# Altium project Sensor_Box_CAN_Shutter_CTRL_STM.PrjPCB
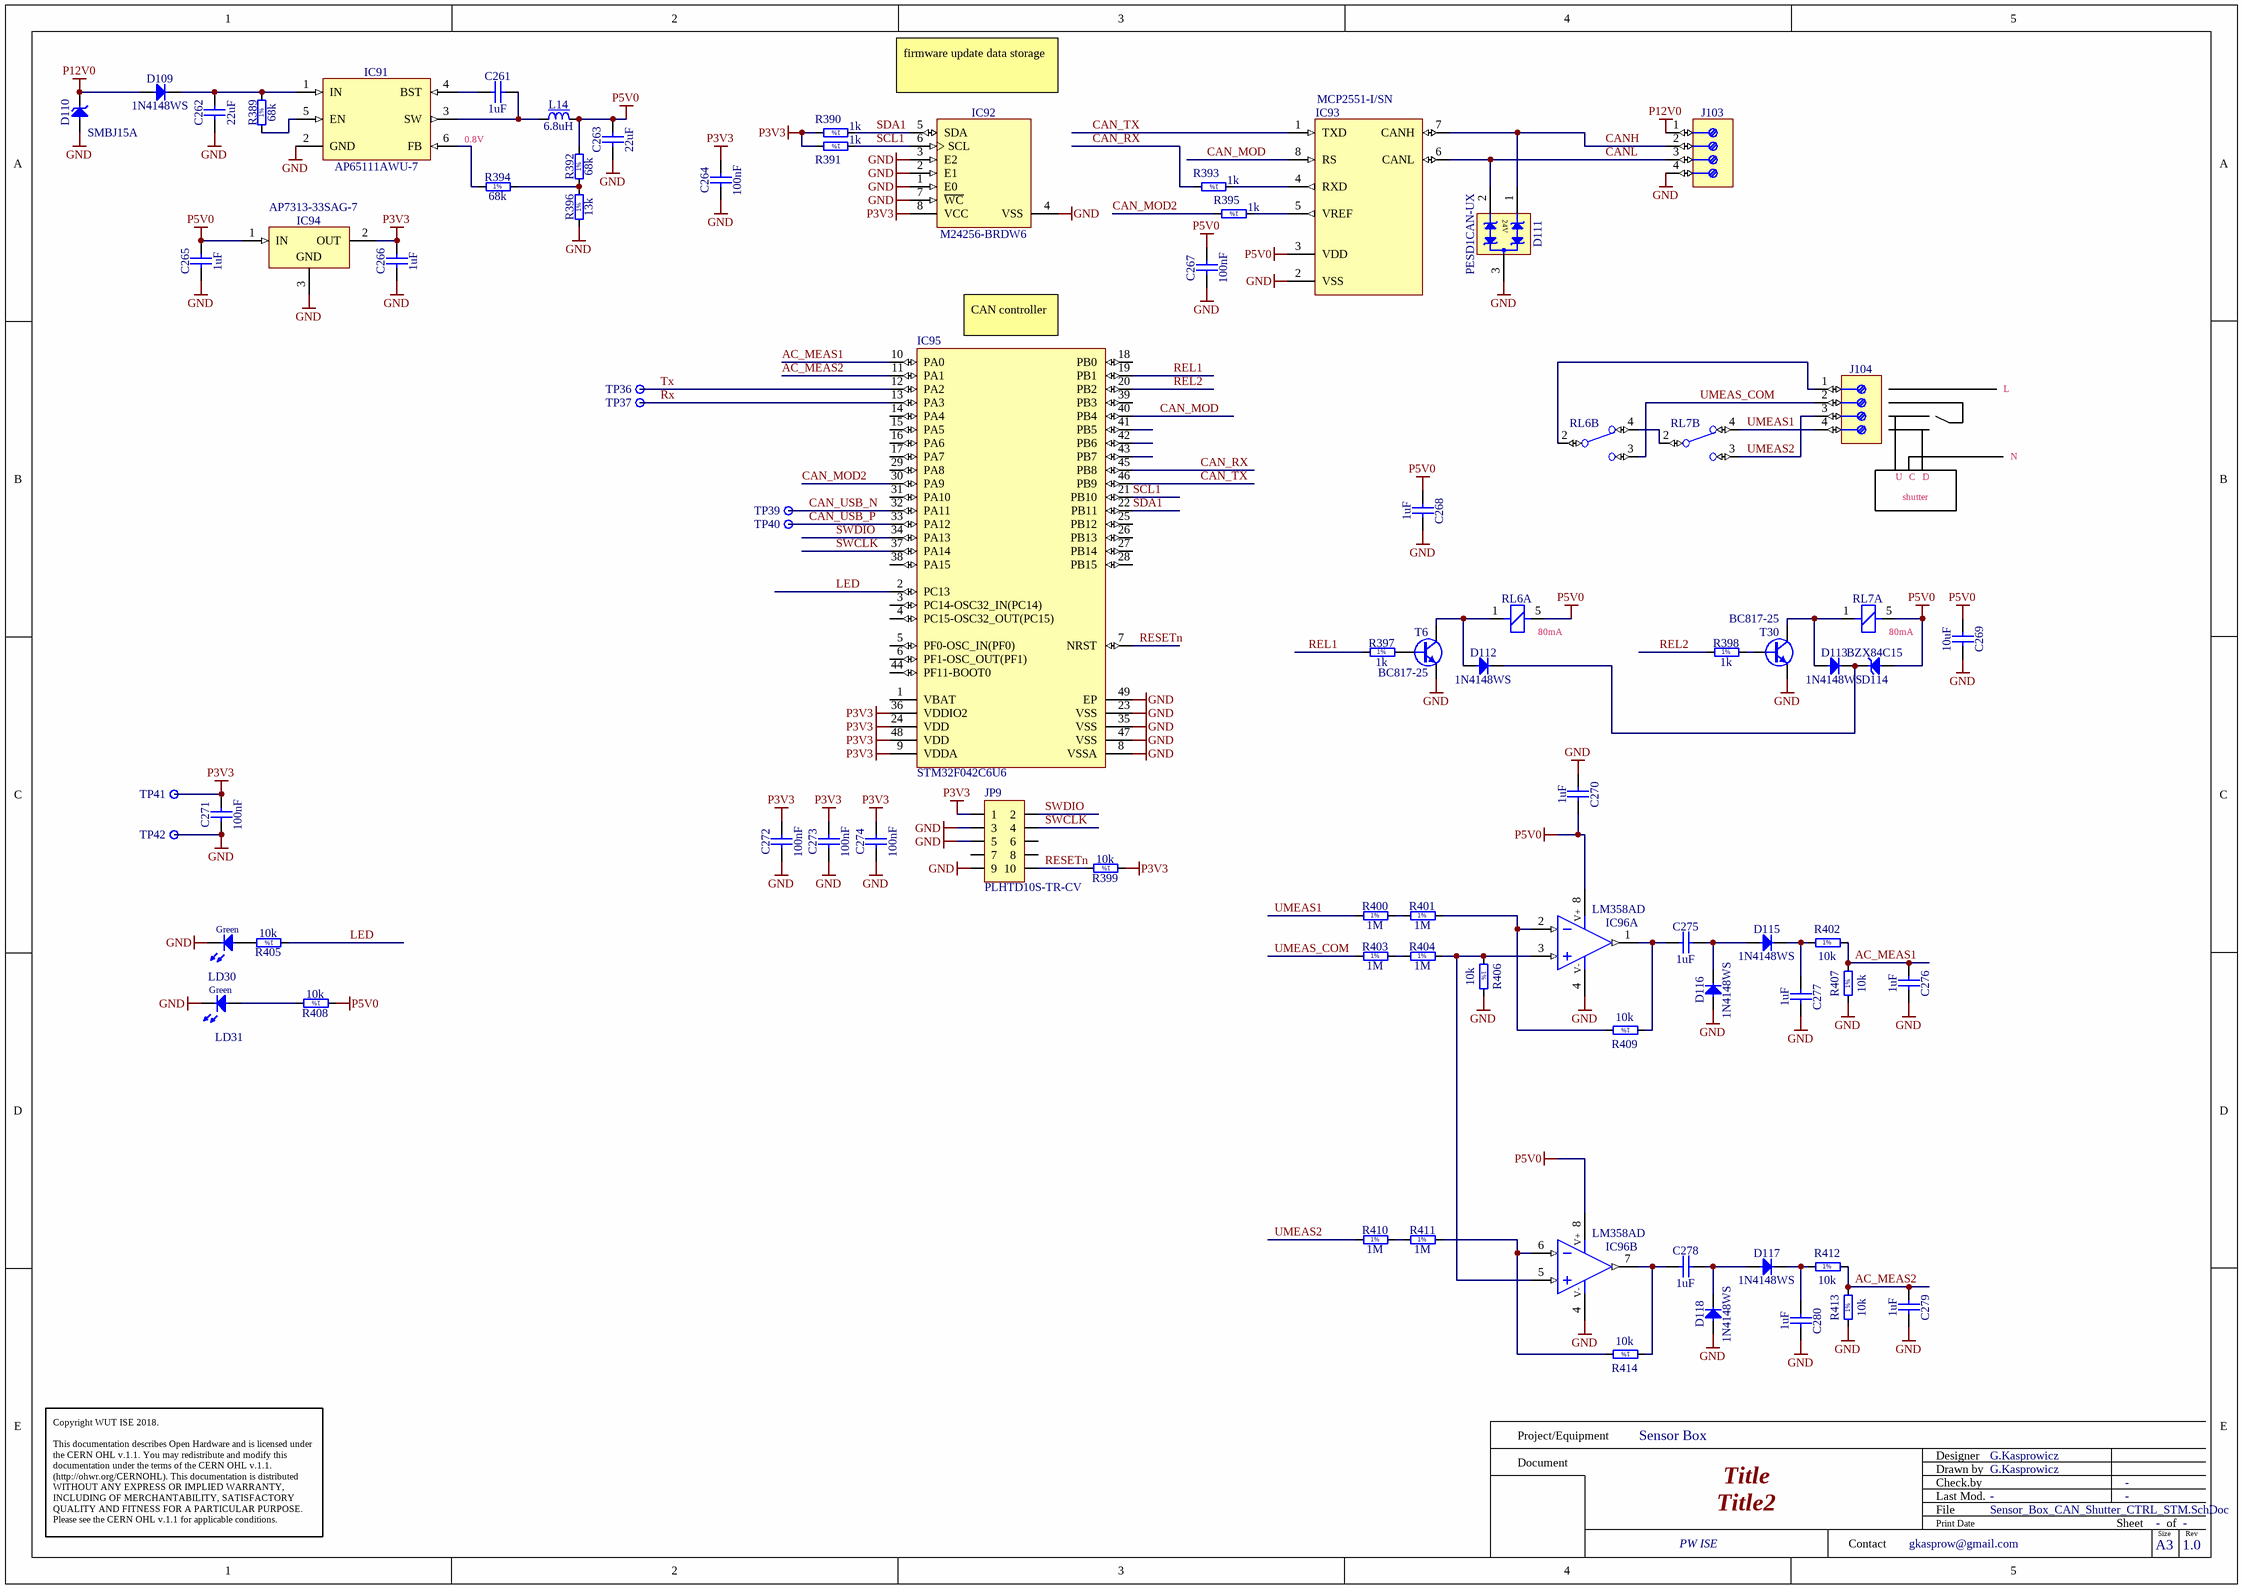
[diagram p0: Sensor_Box_CAN_Shutter_CTRL_STM.SchDoc]
1 sheet, 78 parts. Net scope: global (net labels, ports and power ports of the same name join across sheets).
Board file: Sensor_Box_CAN_Shutter_CTRL_STM.PCBDOC

## Sheet Sensor_Box_CAN_Shutter_CTRL_STM.SchDoc: Title
size 420 x 297 mm; Author: G.Kasprowicz; CompanyName: WUT ISE; DrawnBy: G.Kasprowicz; Organization: WUT ISE; Address1: PW ISE; Address2: Nowowiejska 15/19 00-665 Warsaw; Address3: gkasprow@gmail.com; Revision: 1.0; SheetNumber: -; SheetTotal: -; ModifiedBy: -; CheckedDate: -; Title2: Title2; DivGrp: WUT ISE; Designer: G.Kasprowicz; ModifiedDate: -; ProjectName: Sensor Box

### Parts
C261  1uF  [CAPC1005X55N]
C262  22uF  [CAPC1709X100N]
C263  22uF  [CAPC1709X100N]
C264  100nF  [CAPC1005X55N]
C265  1uF  [CAPC1005X55N]
C266  1uF  [CAPC1005X55N]
C267  100nF  [CAPC1005X55N]
C268  1uF  [CAPC1005X55N]
C269  10uF  [CAPC2012X135N]
C270  1uF  [CAPC1005X55N]
C271  100nF  [CAPC1005X55N]
C272  100nF  [CAPC1005X55N]
C273  100nF  [CAPC1005X55N]
C274  100nF  [CAPC1005X55N]
C275  1uF  [CAPC1005X55N]
C276  1uF  [CAPC1005X55N]
C277  1uF  [CAPC1005X55N]
C278  1uF  [CAPC1005X55N]
C279  1uF  [CAPC1005X55N]
C280  1uF  [CAPC1005X55N]
D109  1N4148WS  [SODFL2512X100N]
D110  SMBJ15A  [DIOM5336X265N]
D111  PESD1CAN-UX  [SOT95P237X112-3N]
D112  1N4148WS  [SODFL2512X100N]
D113  1N4148WS  [SODFL2512X100N]
D114  BZX84C15  [SOT95P240X130-3N]
D115  1N4148WS  [SODFL2512X100N]
D116  1N4148WS  [SODFL2512X100N]
D117  1N4148WS  [SODFL2512X100N]
D118  1N4148WS  [SODFL2512X100N]
IC91  AP65111AWU-7  [SOT95P280X100-6N]
IC92  M24256-BRDW6  [SOP65P640X120-8N]
IC93  MCP2551-I/SN  [SOIC127P600X175-8N]
IC94  AP7313-33SAG-7  [SOT95P240X130-3N]
IC95  STM32F042C6U6  [STM-UFQFPN48_L]
IC96  LM358AD  [SOIC127P600X175-8N]  (parts A,B of 2)
J103  (no value)  [PHOENIX_1725672]
J104  (no value)  [TYCO_282836-4]
JP9  PLHTD10S-TR-CV  [PLHTD10S-TR-CV]
L14  6.8uH  [IND_WALSIN_WLPN3030]
LD30  Green  [LED_KINGBRIGHT_KPH-1608CGCK]
LD31  Green  [LED_KINGBRIGHT_KPH-1608CGCK]
R389  68k  [RESC1005X40N]
R390  1k  [RESC1005X40N]
R391  1k  [RESC1005X40N]
R392  68k  [RESC1005X40N]
R393  1k  [RESC1005X40N]
R394  68k  [RESC1005X40N]
R395  1k  [RESC1005X40N]
R396  13k  [RESC1005X40N]
R397  1k  [RESC1005X40N]
R398  1k  [RESC1005X40N]
R399  10k  [RESC1005X40N]
R400  1M  [RESC3216X65N]
R401  1M  [RESC3216X65N]
R402  10k  [RESC1005X40N]
R403  1M  [RESC3216X65N]
R404  1M  [RESC3216X65N]
R405  10k  [RESC1005X40N]
R406  10k  [RESC1005X40N]
R407  10k  [RESC1005X40N]
R408  10k  [RESC1005X40N]
R409  10k  [RESC1005X40N]
R410  1M  [RESC3216X65N]
R411  1M  [RESC3216X65N]
R412  10k  [RESC1005X40N]
R413  10k  [RESC1005X40N]
R414  10k  [RESC1005X40N]
RL6  REL_OMRON_G5Q-1  [REL_OMRON_G5Q-1]  (value not drawn)  (parts A,B of 2)
RL7  REL_OMRON_G5Q-1  [REL_OMRON_G5Q-1]  (value not drawn)  (parts A,B of 2)
T6  BC817-25  [SOT95P230X110-3N]
T30  BC817-25  [SOT95P230X110-3N]
TP36  Test Point  [TPS127]  (value not drawn)
TP37  Test Point  [TPS127]  (value not drawn)
TP39  Test Point  [TPS127]  (value not drawn)
TP40  Test Point  [TPS127]  (value not drawn)
TP41  Test Point  [TPS127]  (value not drawn)
TP42  Test Point  [TPS127]  (value not drawn)

### Nets
GND: C262.1 C263.1 C264.1 C265.1 C266.1 C267.1 C268.2 C269.2 C270.1 C271.1 C272.1 C273.1 C274.1 C276.2 C277.2 C279.2 C280.2 D110.2(A) D111.3(GND) D116.2(A) D118.2(A) IC91.2(GND) IC92.1(E0) IC92.2(E1) IC92.3(E2) IC92.4(VSS) IC92.7(~{WC}) IC93.2(VSS) IC94.3(GND) IC95.8(VSSA) IC95.23(VSS) IC95.35(VSS) IC95.47(VSS) IC95.49(EP) IC96.4(V-) J103.4 JP9.3 JP9.5 JP9.9 LD30.1(C) LD31.1(C) R396.1 R406.2 R407.1 R413.1 T6.2(E) T30.2(E) TP42.1
P3V3: C264.2 C266.2 C271.2 C272.2 C273.2 C274.2 IC92.8(VCC) IC94.2(OUT) IC95.9(VDDA) IC95.24(VDD) IC95.36(VDDIO2) IC95.48(VDD) JP9.1 R390.2 R391.2 R399.1 TP41.1
P5V0: C263.2 C265.2 C267.2 C268.1 C269.1 C270.2 D114.1(A) IC93.3(VDD) IC94.1(IN) IC96.8(V+) L14.2 R392.2 R408.1 RL6.5 RL7.5
P12V0: D109.2(A) D110.1(C) J103.1
AC_MEAS1: C276.1 IC95.10(PA0) R402.2 R407.2
AC_MEAS2: C279.1 IC95.11(PA1) R412.2 R413.2
CAN_MOD: IC93.8(RS) IC95.40(PB4)
CAN_MOD2: IC95.30(PA9) R395.2
CAN_RX: IC95.45(PB8) R393.2
CAN_TX: IC93.1(TXD) IC95.46(PB9)
CAN_USB_N: IC95.32(PA11) TP39.1
CAN_USB_P: IC95.33(PA12) TP40.1
CANH: D111.1(I/O1) IC93.7(CANH) J103.2
CANL: D111.2(I/O2) IC93.6(CANL) J103.3
LED: IC95.2(PC13) R405.1
REL1: IC95.19(PB1) R397.1
REL2: IC95.20(PB2) R398.1
RESETn: IC95.7(NRST) JP9.10 R399.2
Rx: IC95.13(PA3) TP37.1
SCL1: IC92.6(SCL) IC95.21(PB10) R391.1
SDA1: IC92.5(SDA) IC95.22(PB11) R390.1
SWCLK: IC95.37(PA14) JP9.4
SWDIO: IC95.34(PA13) JP9.2
Tx: IC95.12(PA2) TP36.1
UMEAS1: J104.4 R400.1 RL7.4(NC)
UMEAS2: J104.3 R410.1 RL7.3(NO)
UMEAS_COM: J104.2 R403.1 RL6.3(NO)
NetC261_1: C261.1 IC91.4(BST)
NetC261_2: C261.2 IC91.3(SW) L14.1
NetC262_2: C262.2 D109.1(C) IC91.1(IN) R389.2
NetC275_1: C275.1 IC96.1(OUT) R409.1
NetC275_2: C275.2 D115.2(A) D116.1(C)
NetC277_1: C277.1 D115.1(C) R402.1
NetC278_1: C278.1 IC96.7(OUT) R414.1
NetC278_2: C278.2 D117.2(A) D118.1(C)
NetC280_1: C280.1 D117.1(C) R412.1
NetD112_1: D112.1(C) D113.1(C) D114.3(C)
NetD112_2: D112.2(A) RL6.1 T6.3(C)
NetD113_2: D113.2(A) RL7.1 T30.3(C)
NetIC91_5: IC91.5(EN) R389.1
NetIC91_6: IC91.6(FB) R394.1
NetIC93_4: IC93.4(RXD) R393.1
NetIC93_5: IC93.5(VREF) R395.1
NetIC96_2: IC96.2(IN-) R401.2 R409.2
NetIC96_3: IC96.3(IN+) IC96.5(IN+) R404.2 R406.1
NetIC96_6: IC96.6(IN-) R411.2 R414.2
NetJ104_1: J104.1 RL6.2(C)
NetLD30_2: LD30.2(A) R405.2
NetLD31_2: LD31.2(A) R408.2
NetR392_1: R392.1 R394.2 R396.2
NetR397_2: R397.2 T6.1(B)
NetR398_2: R398.2 T30.1(B)
NetR400_2: R400.2 R401.1
NetR403_2: R403.2 R404.1
NetR410_2: R410.2 R411.1
NetRL6_4: RL6.4(NC) RL7.2(C)

Not connected (* = marked no-connect by the designer): IC95 1(VBAT) 3(PC14-OSC32_IN(PC14)) 4(PC15-OSC32_OUT(PC15)) 5(PF0-OSC_IN(PF0)) 6(PF1-OSC_OUT(PF1)) 14(PA4) 15(PA5) 16(PA6) 17(PA7) 18(PB0) 25(PB12) 26(PB13) 27(PB14) 28(PB15) 29(PA8) 31(PA10) 38(PA15) 39(PB3) 41(PB5) 42(PB6) 43(PB7) 44(PF11-BOOT0); JP9 6 7 8

### Notes on the sheet
- firmware update data storage
- 0.8V
- (near IC95) CAN controller
- L
- N
- U
- shutter
- C
- D
- (near RL6) 80mA
- (near RL7) 80mA
- Project/Equipment
- Document
- Designer
- Drawn by
- Check.by
- Copyright WUT ISE 2018.
  This documentation describes Open Hardware and is licensed under the CERN OHL v.1.1. You may redistribute and modify this documentation under the terms of the CERN OHL v.1.1. (http://ohwr.org/CERNOHL). This documentation is distributed WITHOUT ANY EXPRESS OR IMPLIED WARRANTY, INCLUDING OF MERCHANTABILITY, SATISFACTORY QUALITY AND FITNESS FOR A PARTICULAR PURPOSE. Please see the CERN OHL v.1.1 for applicable conditions.
- Contact
- File
- Last Mod.
- Print Date
- Sheet
- Size
- A3
- of
- Rev
- (in symbol R0402_1K_1%_0.0625W_100PPM) 1%
- (in symbol R0402_10K_1%_0.0625W_100PPM) 1%
- (in symbol R0402_13K_1%_0.0625W_100PPM) 1%
- (in symbol R0402_68K_1%_0.0625W_100PPM) 1%
- (in symbol R1206_1M_1%_0.25W_100PPM) 1%

### Library data of the parts
C261 C265 C266 C268 C270 C275-C280 = CC0402_1UF_16V_10%_X5R: Non-polarised capacitor; Part Description: SMD Multilayer Chip Ceramic Capacitor; Manufacturer: GENERIC; Manufacturer1 Part Number: C1005X5R1C105KT; Voltage: 16V; TC: X5R; Tolerance: ±10%; Part Number: CC0402_1UF_16V_10%_X5R; Component Kind: Standard; Component Type: Standard; Pin Count: 2; Value: 1uF; Status: Preferred; Manufacturer Part Number: CC0402_1UF_16V_10%_X5R; Case: 0402; Mounted: Yes; Socket: No; SMD: Yes; Sense: No; Manufacturer1 Example: TDK; Manufacturer1 ComponentHeight: 0.55mm; HelpURL: \\cern.ch\dfs\Applications\Altium\Datasheets\CC0402_X5R_TDK_C.pdf; Author: CERN DEM JLC; CreateDate: 25.10.2012; LatestRevisionDate: 25.10.2012
C262 C263 = CC0603_22UF_6.3V_20%_X5R: Non-polarised capacitor; Part Description: SMD Multilayer Chip Ceramic Capacitor; Manufacturer: GENERIC; Manufacturer1 Part Number: C1608X5R0J226M080AC; Voltage: 6.3V; TC: X5R; Tolerance: ±20%; Part Number: CC0603_22UF_6.3V_20%_X5R; Component Kind: Standard; Component Type: Standard; Pin Count: 2; Value: 22uF; Status: None; Manufacturer Part Number: CC0603_22UF_6.3V_20%_X5R; Case: 0603; Mounted: Yes; Socket: No; SMD: Yes; Sense: No; Manufacturer1 Example: TDK; Manufacturer1 ComponentHeight: 1mm; HelpURL: \\cern.ch\dfs\Applications\Altium\Datasheets\CC0603_X5R_TDK_C.pdf; Author: CERN DEM JLC; CreateDate: 16.12.2013; LatestRevisionDate: 13.09.2016
C264 C267 C271-C274 = CC0402_100NF_16V_10%_X5R: Non-polarised capacitor; Part Description: SMD Multilayer Chip Ceramic Capacitor; Manufacturer: GENERIC; Manufacturer1 Part Number: GRM155R61C104KA88D; Voltage: 16V; TC: X5R; Tolerance: ±10%; Part Number: CC0402_100NF_16V_10%_X5R; Component Kind: Standard; Component Type: Standard; Pin Count: 2; Value: 100nF; Status: None; Manufacturer Part Number: CC0402_100NF_16V_10%_X5R; Case: 0402; Mounted: Yes; Socket: No; SMD: Yes; Sense: No; Manufacturer1 Example: MURATA; Manufacturer1 ComponentHeight: 0.55mm; HelpURL: \\cern.ch\dfs\Applications\Altium\Datasheets\CC0402_X5R_MURATA_GRM.pdf; Author: CERN DEM JLC; CreateDate: 10.12.2013; LatestRevisionDate: 10.12.2013
C269 = CC0805_10UF_16V_10%_X5R: Non-polarised capacitor; Part Description: SMD Multilayer Chip Ceramic Capacitor; Manufacturer: GENERIC; Manufacturer1 Part Number: C0805C106K4PAC; Voltage: 16V; TC: X5R; Tolerance: ±10%; Part Number: CC0805_10UF_16V_10%_X5R; Component Kind: Standard; Component Type: Standard; Pin Count: 2; Value: 10uF; Status: Preferred; Manufacturer Part Number: CC0805_10UF_16V_10%_X5R; Case: 0805; Mounted: Yes; Socket: No; SMD: Yes; Manufacturer1 Example: KEMET; Manufacturer1 ComponentHeight: 1.4mm; HelpURL: \\cern.ch\dfs\Applications\Altium\Datasheets\CC1206_X5R_KEMET.pdf; Author: CERN DEM JLC; CreateDate: 03.12.2007; LatestRevisionDate: 03.12.2007; Sense: No
D109 D112 D113 D115-D118 = 1N4148WS: Diode; Part Description: Small Signal Diodes; Manufacturer: FAIRCHILD SEMICONDUCTOR; Voltage: 75V; Power: 150mA; PressFit: No; Bonding: No; Part Number: 1N4148WS; Component Kind: Standard; Component Type: Standard; Device: 1N4148WS; PackageDescription: SODFL Diode; 1.70mm W X 1.25mm L X 1.00mm H body, IPC Medium Density; Manufacturer Part Number: 1N4148WS; Pin Count: 2; Case: SOD-323F; Mounted: Yes; Socket: No; SMD: Yes; Sense: No; ComponentHeight: 1mm; HelpURL: \\cern.ch\dfs\Applications\Altium\Datasheets\1N4148WS.pdf; Author: CERN DEM JLC; CreateDate: 12.05.2011; LatestRevisionDate: 12.05.2011
D110 = SMBJ15A: Zener Diode; Part Description: Uni-Directional Transient Voltage Suppressor Diode; Manufacturer: FAIRCHILD SEMICONDUCTOR; Voltage: 15V; Power: 600W; PressFit: No; Bonding: No; Part Number: SMBJ15A; Component Kind: Standard; Component Type: Standard; Device: SMBJ15A; PackageDescription: DO-214-AA/SMB Diode, Molded Body; 5.34mm L X 3.625mm W X 2.65mm H, IPC Medium Density; Manufacturer Part Number: SMBJ15A; Pin Count: 2; Case: DO-214AA; Mounted: Yes; Socket: No; SMD: Yes; Sense: No; ComponentHeight: 2.65mm; HelpURL: \\cern.ch\dfs\Applications\Altium\Datasheets\SMBJ.pdf; Author: CERN DEM JLC; CreateDate: 08.12.2008; LatestRevisionDate: 19.12.2011
D111 = D_TVS_PESD1CAN: TVS Diode for CAN; Manufacturer: Nexperia; Voltage: 24V; Power: 400W; PressFit: No; Bonding: No; Part Number: PESD1CAN-UX; Component Kind: Standard; Component Type: Standard; Device: PESD1CAN-UX; PackageDescription: SOT, 0.95mm, pitch; 3 pin,1.30mm W X 2.92mm L X 1.12mm H body, IPC Medium Density; Part Description: TVS Diode for CAN; Manufacturer Part Number: PESD1CAN-UX; Pin Count: 3; Case: SOT-23; Mounted: Yes; Socket: No; SMD: Yes; Sense: No; ComponentHeight: 1.12mm; HelpURL: \\cern.ch\dfs\Applications\Altium\Datasheets\SM712.TCT.pdf; Author: CERN DEM JLC; CreateDate: 03.09.2014; LatestRevisionDate: 13.01.2015
D114 = BZX84C15: Diode Zener Anode Pin 1 Cathode Pin 3 (Pas de pin 2); Part Description: Zener Diode; Manufacturer: FAIRCHILD SEMICONDUCTOR; Voltage: 15V; Power: 350mW; PressFit: No; Bonding: No; Part Number: BZX84C15; Component Kind: Standard; Component Type: Standard; Device: BZX84C15; PackageDescription: SOT23 3-Leads, Pitch 0.95mm - Body 1.3x2.9mm, IPC Medium Density; Manufacturer Part Number: BZX84C15; Pin Count: 3; Case: SOT23-3; Mounted: Yes; Socket: No; SMD: Yes; Sense: No; ComponentHeight: 1.3mm; HelpURL: \\cern.ch\dfs\Applications\Altium\Datasheets\BZX84C15.pdf; Author: CERN DEM JLC; CreateDate: 30.11.2011; LatestRevisionDate: 30.11.2011
IC91 = AP65111AWU-7: Light Load Improved 1.5A Synch DC/DC Buck Converter; Manufacturer: DIODES INCORPORATED; PressFit: No; Bonding: No; Part Number: AP65111AWU-7; Component Kind: Standard; Component Type: Standard; Device: AP65111AWU-7; PackageDescription: SOT23, 0.95mm pitch; 6 pin, 1.625mm W X 2.90mm L X 1.00mm H body, IPC Medium Density; Part Description: Light Load Improved 1.5A Synch DC/DC Buck Converter; Manufacturer Part Number: AP65111AWU-7; Pin Count: 6; Case: SOT23-6; Mounted: Yes; Socket: No; SMD: Yes; Sense: No; ComponentHeight: 1.1mm; HelpURL: \\cern.ch\dfs\Applications\Altium\Datasheets\AP65111AWU-7.pdf; Author: CERN DEM JLC; CreateDate: 20.03.2018; LatestRevisionDate: 20.03.2018
IC92 = MEM_M24256-BRDW6P: 256-Kbit Serial I²C Bus EEPROM; Manufacturer: ST MICROELECTRONICS; PressFit: No; Bonding: No; Part Number: M24256-BRDW6P; Component Kind: Standard; Component Type: Standard; Device: M24256-BRDW6; PackageDescription: SOP, 0.65mm pitch; 8 pin, 4.40mm W X 3.00mm L X 1.20mm H body, IPC Medium Density; Part Description: 256-Kbit Serial I²C Bus EEPROM; Manufacturer Part Number: M24256-BRDW6; Pin Count: 8; Case: TSSOP8; Mounted: Yes; Socket: No; SMD: Yes; Sense: No; ComponentHeight: 1.2mm; HelpURL: \\cern.ch\dfs\Applications\Altium\Datasheets\M24256-BRDW6P.pdf; Author: CERN DEM MR; CreateDate: 17.03.2016; LatestRevisionDate: 17.03.2016
IC93 = IFC_MCP2551: High-Speed CAN Transceiver, 8-Pin SOIC, Industrial Temperature; Manufacturer: MICROCHIP TECHNOLOGY; PressFit: No; Bonding: No; Part Number: MCP2551-I/SN; Component Kind: Standard; Component Type: Standard; Device: MCP2551-I/SN; PackageDescription: SOIC 8, Pitch 1.27mm - Body 4x5mm, IPC Medium Density; Part Description: High-Speed CAN Transceiver; Manufacturer Part Number: MCP2551-I/SN; Pin Count: 8; Case: SOIC8; Mounted: Yes; Socket: No; SMD: Yes; Sense: No; ComponentHeight: 1.75mm; Author: GK; CreateDate: 07.09.2016; LatestRevisionDate: 07.09.2016
IC94 = AP7313-33SAG-7: 3-Terminal Regulator 1=IN 2=OUT 3=GND; Part Description: 3.3V, 150mA Low Quiescent Current, Fast Transient Low Dropout Linear Regulator; Manufacturer: DIODES INCORPORATED; PressFit: No; Bonding: No; Part Number: AP7313-33SAG-7; Component Kind: Standard; Component Type: Standard; Device: AP7313-33SAG-7; PackageDescription: SOT23 3-Leads, Pitch 0.95mm - Body 1.3x2.9mm, IPC Medium Density; Manufacturer Part Number: AP7313-33SAG-7; Pin Count: 3; Case: SOT23; Mounted: Yes; Socket: No; SMD: Yes; Sense: No; ComponentHeight: 1.35mm; HelpURL: \\cern.ch\dfs\Applications\Altium\Datasheets\AP7313-33SAG-7.pdf; Author: CERN DEM JLC; CreateDate: 20.03.2018; LatestRevisionDate: 20.03.2018
IC95 = CMP-0304-00104-1: ARM Cortex-M0 32-bit MCU, 32 KB Flash, 6 KB Internal RAM, 38 I/Os, 48-Pin UFQFPN, -40 to 85 degC, Tray; Internal RAM Size (kB): 6; Supply Voltage(Vcc) min (V): 2; I/Os (High Current): 38; FLASH Size (Prog) (kB): 32; Operating Frequency(F) (Processor speed) (MHz): 48; ComponentLink2Description: Datasheet; Mounting Technology: Surface Mount; ComponentLink1Description: Manufacturer URL; ComponentLink1URL: http://www.st.com/; Core: ARM Cortex-M0; Package Reference: UFQFPN48; Packing: Tray; ComponentLink2URL: http://www.st.com/st-web-ui/static/active/en/resource/technical/document/datasheet/DM00105814.pdf; DatasheetVersion: Rev. 5; Package Description: 48-Pin Ultra Thin Fine Pitch Quad Flat No-Lead, 7 x 7 x 0.6 mm Body, 0.5 mm Pitch, Exposed Pad
IC96 = LM358AD: Dual Operational Amplifier; Manufacturer: TEXAS INSTRUMENTS; PressFit: No; Bonding: No; Part Number: LM358AD; Component Kind: Standard; Component Type: Standard; Device: LM358AD; PackageDescription: SOIC 8, Pitch 1.27mm - Body 4x5mm, IPC Medium Density; Part Description: Dual Operational Amplifier; Manufacturer Part Number: LM358AD; Pin Count: 8; Case: SOIC8; Mounted: Yes; Socket: No; SMD: Yes; Sense: No; ComponentHeight: 1.75mm; Author: CERN DEM JLC; HelpURL: \\cern.ch\dfs\Applications\Altium\Datasheets\LM358AD.pdf; CreateDate: 02.12.2008; LatestRevisionDate: 13.04.2010
J103 = PHOENIX_1725672: Terminal Block, 4 Positions, Screw Connection; Part Description: 6A, 63V, Terminal Block, Pitch 2.54mm, 4 Positions, Screw Connection; Manufacturer: PHOENIX CONTACT; Manufacturer Part Number: 1725672 (MPT 0,5/4-2,54); PressFit: No; Part Number: PHOENIX_1725672; Component Kind: Standard; Component Type: Standard; Pin Count: 4; Mounted: Yes; Socket: No; SMD: No; Sense: No; Status: None; ComponentHeight: 8.5mm; HelpURL: \\cern.ch\dfs\Applications\Altium\Datasheets\PHOENIX_1725672.pdf; Author: CERN DEM JMW; CreateDate: 07.11.2008; LatestRevisionDate: 26.04.2010
J104 = TYCO_282836-4: Terminal Block, 4 Positions, Screw Connection; Part Description: 15.5A, 300V, Terminal Block, Pitch 5mm, 4 Positions, Screw Connection; Manufacturer: TYCO ELECTRONICS; PressFit: No; Part Number: TYCO_282836-4; Component Kind: Standard; Component Type: Standard; Pin Count: 4; Mounted: Yes; Socket: No; SMD: No; Sense: No; Status: None; Manufacturer Part Number: 282836-4; ComponentHeight: 10mm; HelpURL: \\cern.ch\dfs\Applications\Altium\Datasheets\TYCO_282836-4.pdf; Author: CERN DEM JLC; CreateDate: 10.11.2014; LatestRevisionDate: 10.11.2014
JP9 = CON_2x5 1.27 SMT Male: 1.27 mm dual row goldpin (Maritex)
L14 = IND_WLPN3030: 6,8uH; 900mA; 0,211Ω; 3x3x1,5mm; Part Number: IND_6.8UH_20%_WALSIN_WLPN303015M6R8PB; Part Description: Miniature Surface Mount Power Inductor (8200 Series); Manufacturer: WALSIN; Manufacturer Part Number: WLPN303015M6R8PB; Resistance: 0.21R; Tolerance: ±20%; Component Kind: Standard; Component Type: Standard; Pin Count: 2; Value: 6.8uH; Status: None; Power: 900mA; Mounted: Yes; Socket: No; SMD: Yes; Sense: No; ComponentHeight: 1.5; HelpURL: \\cern.ch\dfs\Applications\Altium\Datasheets\IND_MURATA-PS_8200.pdf; Author: GK; CreateDate: 11.07.2016; LatestRevisionDate: 11.07.2016
LD30 LD31 = LED_KINGBRIGHT_KPH-1608CGCK: LED Green 1C 2A; Part Description: SMD Green LED, Case 1.6mmX0.8mm(0603), 0.65mm Thickness; PressFit: No; Bonding: No; Part Number: LED_KINGBRIGHT_KPH-1608CGCK; Component Kind: Standard; Component Type: Standard; Color: Green; PackageDescription: SMT Green LED, Case 0603, Body L 1.6 x W 0.8mm H 0.65mm; Manufacturer: KINGBRIGHT; Manufacturer Part Number: KPH-1608CGCK; Pin Count: 2; Mounted: Yes; Socket: No; SMD: Yes; Sense: No; ComponentHeight: 0.65mm; HelpURL: \\cern.ch\dfs\Applications\Altium\Datasheets\LED_KINGBRIGHT_KPH-1608CGCK.pdf; Author: CERN DEM JLC; CreateDate: 03.07.2017; LatestRevisionDate: 03.07.2017
R389 R392 R394 = R0402_68K_1%_0.0625W_100PPM: Resistor - 1%; Part Description: General Purpose Thick Film Chip Resistor; Manufacturer: GENERIC; Manufacturer1 Part Number: 232270676803L; TC: ±100ppm/°C; PressFit: No; Part Number: R0402_68K_1%_0.0625W_100PPM; Component Kind: Standard; Component Type: Standard; Pin Count: 2; Value: 68k; Status: Not Recommended; Power: 0.0625W; Tolerance: ±1%; Manufacturer Part Number: R0402_68K_1%_0.0625W_100PPM; Case: 0402; Mounted: Yes; Sense: No; Socket: No; SMD: Yes; Manufacturer1 Example: YAGEO PHYCOMP; Manufacturer1 ComponentHeight: 0.4mm; HelpURL: \\cern.ch\dfs\Applications\Altium\Datasheets\R0402_Phycomp_RC0402.pdf; Author: CERN DEM JLC; CreateDate: 03.12.2007; LatestRevisionDate: 17.10.2012
R390 R391 R393 R395 R397 R398 = R0402_1K_1%_0.0625W_100PPM: Resistor - 1%; Part Description: General Purpose Thick Film Chip Resistor; Manufacturer: GENERIC; Manufacturer1 Part Number: 232270671002L; TC: ±100ppm/°C; PressFit: No; Part Number: R0402_1K_1%_0.0625W_100PPM; Component Kind: Standard; Component Type: Standard; Pin Count: 2; Value: 1k; Status: Not Recommended; Power: 0.0625W; Tolerance: ±1%; Manufacturer Part Number: R0402_1K_1%_0.0625W_100PPM; Case: 0402; Mounted: Yes; Sense: No; Socket: No; SMD: Yes; Manufacturer1 Example: YAGEO PHYCOMP; Manufacturer1 ComponentHeight: 0.4mm; HelpURL: \\cern.ch\dfs\Applications\Altium\Datasheets\R0402_Phycomp_RC0402.pdf; Author: CERN DEM JLC; CreateDate: 03.12.2007; LatestRevisionDate: 17.10.2012
R396 = R0402_13K_1%_0.0625W_100PPM: Resistor - 1%; Part Description: General Purpose Thick Film Chip Resistor; Manufacturer: GENERIC; Manufacturer1 Part Number: 232270671303L; TC: ±100ppm/°C; PressFit: No; Part Number: R0402_13K_1%_0.0625W_100PPM; Component Kind: Standard; Component Type: Standard; Pin Count: 2; Value: 13k; Status: Not Recommended; Power: 0.0625W; Tolerance: ±1%; Manufacturer Part Number: R0402_13K_1%_0.0625W_100PPM; Case: 0402; Mounted: Yes; Sense: No; Socket: No; SMD: Yes; Manufacturer1 Example: YAGEO PHYCOMP; Manufacturer1 ComponentHeight: 0.4mm; HelpURL: \\cern.ch\dfs\Applications\Altium\Datasheets\R0402_Phycomp_RC0402.pdf; Author: CERN DEM JLC; CreateDate: 03.12.2007; LatestRevisionDate: 17.10.2012
R399 R405 R408 = R0402_10K_1%_0.0625W_100PPM: Resistor - 1%; Part Description: General Purpose Thick Film Chip Resistor; Manufacturer: GENERIC; Manufacturer1 Part Number: 232270671003L; TC: ±100ppm/°C; PressFit: No; Part Number: R0402_10K_1%_0.0625W_100PPM; Component Kind: Standard; Component Type: Standard; Pin Count: 2; Value: 10k; Status: Not Recommended; Power: 0.0625W; Tolerance: ±1%; Manufacturer Part Number: R0402_10K_1%_0.0625W_100PPM; Case: 0402; Mounted: Yes; Sense: No; Socket: No; SMD: Yes; Manufacturer1 Example: YAGEO PHYCOMP; Manufacturer1 ComponentHeight: 0.4mm; HelpURL: \\cern.ch\dfs\Applications\Altium\Datasheets\R0402_Phycomp_RC0402.pdf; Author: CERN DEM JLC; CreateDate: 03.12.2007; LatestRevisionDate: 17.10.2012
R400 R401 R403 R404 R410 R411 = R1206_1M_1%_0.25W_100PPM: Resistor - 1%; Part Description: General Purpose Thick Film Chip Resistor; Manufacturer: GENERIC; Manufacturer1 Part Number: NRC12F1004TRF; Power: 0.25W; TC: ±100ppm/°C; PressFit: No; Part Number: R1206_1M_1%_0.25W_100PPM; Component Kind: Standard; Component Type: Standard; Pin Count: 2; Value: 1M; Status: Preferred; Tolerance: ±1%; Manufacturer Part Number: R1206_1M_1%_0.25W_100PPM; Case: 1206; Mounted: Yes; Sense: No; Socket: No; SMD: Yes; Manufacturer1 Example: NIC COMPONENT; Manufacturer1 ComponentHeight: 0.65mm; HelpURL: \\cern.ch\dfs\Applications\Altium\Datasheets\R1206_NIC_NRC.pdf; Author: CERN DEM JLC; CreateDate: 03.12.2007; LatestRevisionDate: 13.03.2008
R402 R406 R407 R409 R412-R414 = R0402_10K_1%_0.0625W_100PPM: Resistor - 1%; Part Description: General Purpose Thick Film Chip Resistor; Manufacturer: GENERIC; Manufacturer1 Part Number: 232270671003L; TC: ±100ppm/°C; Table: Resistors SMD; Part Number: R0402_10K_1%_0.0625W_100PPM; Component Kind: Standard; Component Type: Standard; Pin Count: 2; Value: 10k; Status: Not recommended; Power: 0.0625W; Tolerance: ±1%; Manufacturer Part Number: R0402_10K_1%_0.0625W_100PPM; Case: 0402; Mounted: Yes; Socket: No; SMD: Yes; Manufacturer1 Example: YAGEO PHYCOMP; Manufacturer1 ComponentHeight: 0.4mm; HelpURL: \\cern.ch\dfs\Applications\Altium\Datasheets\R0402_Phycomp_RC0402.pdf; Author: CERN DEM JLC; CreateDate: 2007-12-03; LatestRevisionDate: 2012-10-17
RL6 RL7 = REL_OMRON_G5Q-1-5VDC: SPDT, Power Relay, 10A Switching Capacity, G5Q-1 Series; Manufacturer: OMRON ELECTRONIC; Manufacturer Part Number: G5Q-1-DC5; PressFit: No; Value: 5VDC; Part Number: REL_OMRON_G5Q-1-5VDC; Component Kind: Standard; Component Type: Standard; Pin Count: 5; PackageDescription: 5 Leads, Row Spacing 7.62mm; Body 20.3mm x 10.3mm, OMRON_G5Q-1 Series; Mounted: Yes; Socket: No; SMD: No; Sense: No; Status: None; Part Description: SPDT, Power Relay, 10A Switching Capacity, G5Q-1 Series; ComponentHeight: 15.8mm; HelpURL: \\cern.ch\dfs\Applications\Altium\Datasheets\REL_OMRON_G5Q-1.pdf; Author: CERN DEM MR; CreateDate: 09.06.2016; LatestRevisionDate: 09.06.2016
T6 T30 = BC817-25: NPN Transistor; Part Description: 45V 500mA NPN General-Purpose Transistor; Manufacturer: NXP SEMICONDUCTORS; PressFit: No; Bonding: No; Part Number: BC817-25; Component Kind: Standard; Component Type: Standard; Device: BC817-25; PackageDescription: SOT23, 3 pin, Pitch 0.95mm - 1.3mm W X 2.9mm L X 1.1mm H, IPC Medium Density; Manufacturer Part Number: BC817-25; Pin Count: 3; Case: SOT23-3; Mounted: Yes; Socket: No; SMD: Yes; Sense: No; ComponentHeight: 1.1mm; HelpURL: \\cern.ch\dfs\Applications\Altium\Datasheets\BC817-25.pdf; Author: CERN DEM JLC; CreateDate: 28.10.2014; LatestRevisionDate: 28.10.2014
TP36 TP37 TP39-TP42 = SMD_PAD_1.27X1.27MM: Part Description: 1.27mm x 1.27mm PCB Copper Area (SMD Test Point); Mounted: No; Part Number: SMD_PAD_1.27X1.27MM; Component Kind: Standard (No BOM); Component Type: Standard (No BOM); Pin Count: 1; Family: Test Point; Socket: No; SMD: Yes; Sense: No; Status: None; ComponentHeight: 0mm; HelpURL: Undefined; Author: CERN DEM JLC; CreateDate: 12.01.2008; LatestRevisionDate: 12.01.2008; PackageDescription: 1.27mm x 1.27mm PCB Copper Area (SMD Test Point)